# EAGLE design mega328_withheaders_andxbee (EAGLE 6.3)
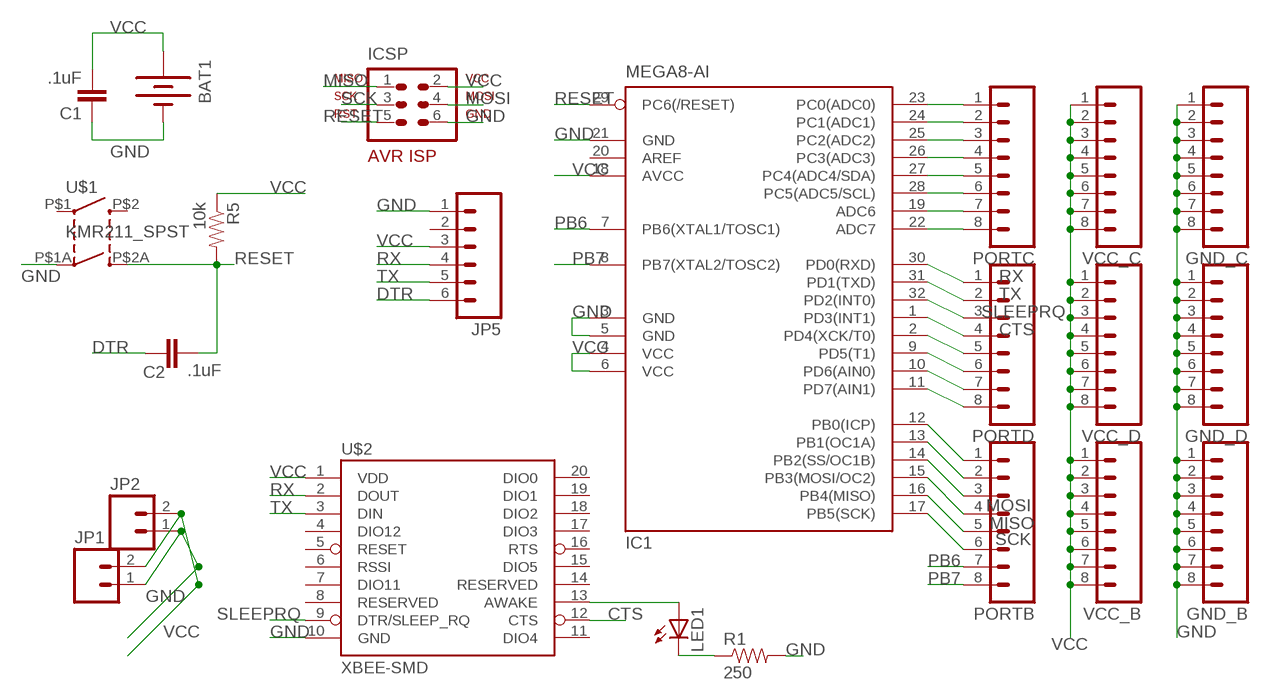
[diagram p0: schematic, sheet 1]

## Parts
BAT1  BATTERY20SMD  [BATTCON_20MM]
C1  .1uF  CAP0603-CAP  [0603-CAP]
C2  .1uF  CAP0603-CAP  [0603-CAP]
GND_B  M081X08  [1X08]
GND_C  M081X08  [1X08]
GND_D  M081X08  [1X08]
IC1  MEGA8-AI  [TQFP32-08]
ICSP  ISP  AVR-ISP-6VERT  [AVR-ISP-6]
JP1  M02PTH  [1X02]
JP2  M02PTH  [1X02]
JP5  M06SIP  [1X06]
LED1  LEDCHIP-LED0603  [CHIP-LED0603]
PORTB  M081X08  [1X08]
PORTC  M081X08  [1X08]
PORTD  M081X08  [1X08]
R1  250  RESISTOR0603-RES  [0603-RES]
R5  10k  RESISTOR0603-RES  [0603-RES]
U$1  KMR211_SPST  [KMR211_SPST]
U$2  XBEE-SMD  [XBEE-SMD]
VCC_B  M081X08  [1X08]
VCC_C  M081X08  [1X08]
VCC_D  M081X08  [1X08]

## Nets
B0: IC1.12(PB0(ICP)) PORTB.1
C0: IC1.23(PC0(ADC0)) PORTC.1
CTS: IC1.1(PD3(INT1)) PORTD.4 U$2.12(CTS)
DTR: C2.1 JP5.6
GND: BAT1.2(-) C1.1 GND_B.1 GND_B.2 GND_B.3 GND_B.4 GND_B.5 GND_B.6 GND_B.7 GND_B.8 GND_C.1 GND_C.2 GND_C.3 GND_C.4 GND_C.5 GND_C.6 GND_C.7 GND_C.8 GND_D.1 GND_D.2 GND_D.3 GND_D.4 GND_D.5 GND_D.6 GND_D.7 GND_D.8 IC1.3(GND) IC1.5(GND) IC1.21(GND) ICSP.6 JP1.1 JP2.1 JP5.1 R1.2 U$1.P$1A(1B) U$2.10(GND)
MISO: IC1.16(PB4(MISO)) ICSP.1 PORTB.5
MOSI: IC1.15(PB3(MOSI/OC2)) ICSP.4 PORTB.4
N$2: IC1.24(PC1(ADC1)) PORTC.2
N$3: IC1.25(PC2(ADC2)) PORTC.3
N$4: IC1.26(PC3(ADC3)) PORTC.4
N$5: IC1.27(PC4(ADC4/SDA)) PORTC.5
N$6: IC1.28(PC5(ADC5/SCL)) PORTC.6
N$7: IC1.19(ADC6) PORTC.7
N$8: IC1.22(ADC7) PORTC.8
N$13: IC1.2(PD4(XCK/T0)) PORTD.5
N$14: IC1.9(PD5(T1)) PORTD.6
N$15: IC1.10(PD6(AIN0)) PORTD.7
N$16: IC1.11(PD7(AIN1)) PORTD.8
N$17: IC1.14(PB2(SS/OC1B)) PORTB.3
N$18: IC1.13(PB1(OC1A)) PORTB.2
N$20: LED1.A U$2.13(AWAKE)
N$21: LED1.C R1.1
PB6: IC1.7(PB6(XTAL1/TOSC1)) PORTB.7
PB7: IC1.8(PB7(XTAL2/TOSC2)) PORTB.8
RESET: C2.2 IC1.29(PC6(/RESET)) ICSP.5 R5.2 U$1.P$2A(2B)
RX: IC1.30(PD0(RXD)) JP5.4 PORTD.1 U$2.2(DOUT)
SCK: IC1.17(PB5(SCK)) ICSP.3 PORTB.6
SLEEPRQ: IC1.32(PD2(INT0)) PORTD.3 U$2.9(DTR/SLEEP_RQ)
TX: IC1.31(PD1(TXD)) JP5.5 PORTD.2 U$2.3(DIN)
VCC: BAT1.1(+) C1.2 IC1.4(VCC) IC1.6(VCC) IC1.18(AVCC) ICSP.2 JP1.2 JP2.2 JP5.3 R5.1 U$2.1(VDD) VCC_B.1 VCC_B.2 VCC_B.3 VCC_B.4 VCC_B.5 VCC_B.6 VCC_B.7 VCC_B.8 VCC_C.1 VCC_C.2 VCC_C.3 VCC_C.4 VCC_C.5 VCC_C.6 VCC_C.7 VCC_C.8 VCC_D.1 VCC_D.2 VCC_D.3 VCC_D.4 VCC_D.5 VCC_D.6 VCC_D.7 VCC_D.8
Unconnected: IC1.20(AREF) JP5.2 U$1.P$1(1A) U$1.P$2(2A) U$2.4(DIO12) U$2.5(RESET) U$2.6(RSSI) U$2.7(DIO11) U$2.8(RESERVED) U$2.11(DIO4) U$2.14(RESERVED) U$2.15(DIO5) U$2.16(RTS) U$2.17(DIO3) U$2.18(DIO2) U$2.19(DIO1) U$2.20(DIO0)

## Library data of the parts
BAT1 = SparkFun-Electromechanical:BATTERY: Battery Holders Various common sizes : AA, AAA, 20mm coin cell and 12mm coin cell.
C1 C2 = SparkFun-Passives:CAP: Capacitor Standard 0603 ceramic capacitor, and 0.1" leaded capacitor.
GND_B GND_C GND_D PORTB PORTC PORTD VCC_B VCC_C VCC_D = SparkFun-Connectors:M08: Header 8 Standard 8-pin 0.1" header. Use with straight break away headers (SKU : PRT-00116), right angle break away headers (PRT-00553), swiss pins (PRT-00743), machine pins (PRT-00117), and female headers (PRT-00115).
IC1 = atmel:MEGA8: MICROCONTROLLER 8 Kbytes FLASH, 1 kbytes SRAM, 512 bytes EEPROM, USART, 6-channel 10 bit ADC, 2-channel 8 bit ADC Pin compatible with Atmega48, ATMega88, ATMega168 Source: avr.lbr; MPN: ATMEGA8-16AU; OC_FARNELL: 9171371; OC_NEWARK: 73M8863
ICSP = avr-7:AVR-ISP-6: AVR ISP-6 Serial Programming Header
JP1 JP2 = SparkFun-Connectors:M02: Header 2 Standard 2-pin 0.1" header. Use with straight break away headers (SKU : PRT-00116), right angle break away headers (PRT-00553), swiss pins (PRT-00743), machine pins (PRT-00117), and female headers (PRT-00115). Molex polarized connector foot print use with SKU : PRT-08233 with associated crimp pins and housings.
JP5 = SparkFun-Connectors:M06: Header 6 Standard 6-pin 0.1" header. Use with straight break away headers (SKU : PRT-00116), right angle break away headers (PRT-00553), swiss pins (PRT-00743), machine pins (PRT-00117), and female headers (PRT-00115). Molex polarized connector foot print use with SKU : PRT-08094 with associated crimp pins and housings. NOTES ON THE VARIANTS LOCK and LOCK_LONGPADS... This footprint was designed to help hold the alignment of a through-hole component (i.e. 6-pin header) while soldering it into place. You may notice that each hole has been shifted either up or down by 0.005 of an inch from it's more standard position (which is a perfectly straight line). This slight alteration caused the pins (the squares in the middle) to touch the edges of the holes. Because they are alternating, it causes a "brace" to hold the component in place. 0.005 has proven to be the perfect amount of "off-center" position when using our standard breakaway headers. Although looks a little odd when you look at the bare footprint, once you have a header in there, the alteration is very hard to notice. Also, if you push a header all the way into place, it is covered up entirely on the bottom side. This idea of altering the position of holes to aid alignment will be further integrated into the Sparkfun Library for other footprints. It can help hold any component with 3 or more connection pins.
LED1 = adafruit:LED: LED OSRAM: - CHIPLED LG R971, LG N971, LY N971, LG Q971, LY Q971, LO R971, LY R971 LH N974, LH R974 LS Q976, LO Q976, LY Q976 LO Q996 - Hyper CHIPLED LW Q18S LB Q993, LB Q99A, LB R99A - SideLED LS A670, LO A670, LY A670, LG A670, LP A670 LB A673, LV A673, LT A673, LW A673 LH A674 LY A675 LS A676, LA A676, LO A676, LY A676, LW A676 LS A679, LY A679, LG A679 - Hyper Micro SIDELED® LS Y876, LA Y876, LO Y876, LY Y876 LT Y87S - SmartLED LW L88C, LW L88S LB L89C, LB L89S, LG L890 LS L89K, LO L89K, LY L89K LS L896, LA L896, LO L896, LY L896 - TOPLED LS T670, LO T670, LY T670, LG T670, LP T670 LSG T670, LSP T670, LSY T670, LOP T670, LYG T670 LG T671, LOG T671, LSG T671 LB T673, LV T673, LT T673, LW T673 LH T674 LS T676, LA T676, LO T676, LY T676, LB T676, LH T676, LSB T676, LW T676 LB T67C, LV T67C, LT T67C, LS T67K, LO T67K, LY T67K, LW E67C LS E67B, LA E67B, LO E67B, LY E67B, LB E67C, LV E67C, LT E67C LW T67C LS T679, LY T679, LG T679 LS T770, LO T770, LY T770, LG T770, LP T770 LB T773, LV T773, LT T773, LW T773 LH T774 LS E675, LA E675, LY E675, LS T675 LS T776, LA T776, LO T776, LY T776, LB T776 LHGB T686 LT T68C, LB T68C - Hyper Mini TOPLED® LB M676 - Mini TOPLED Santana® LG M470 LS M47K, LO M47K, LY M47K Source: http://www.osram.convergy.de/
R1 = my library:RESISTOR: Resistor Basic schematic elements and footprints for 0603, 1206, and PTH resistors.
R5 = SparkFun-Passives:RESISTOR: Resistor Basic schematic elements and footprints for 0603, 1206, and PTH resistors.
U$1 = my library:KMR211_SPST: KMR, KMR211, SPST
U$2 = my library:XBEE-SMD: XBEE

## Board
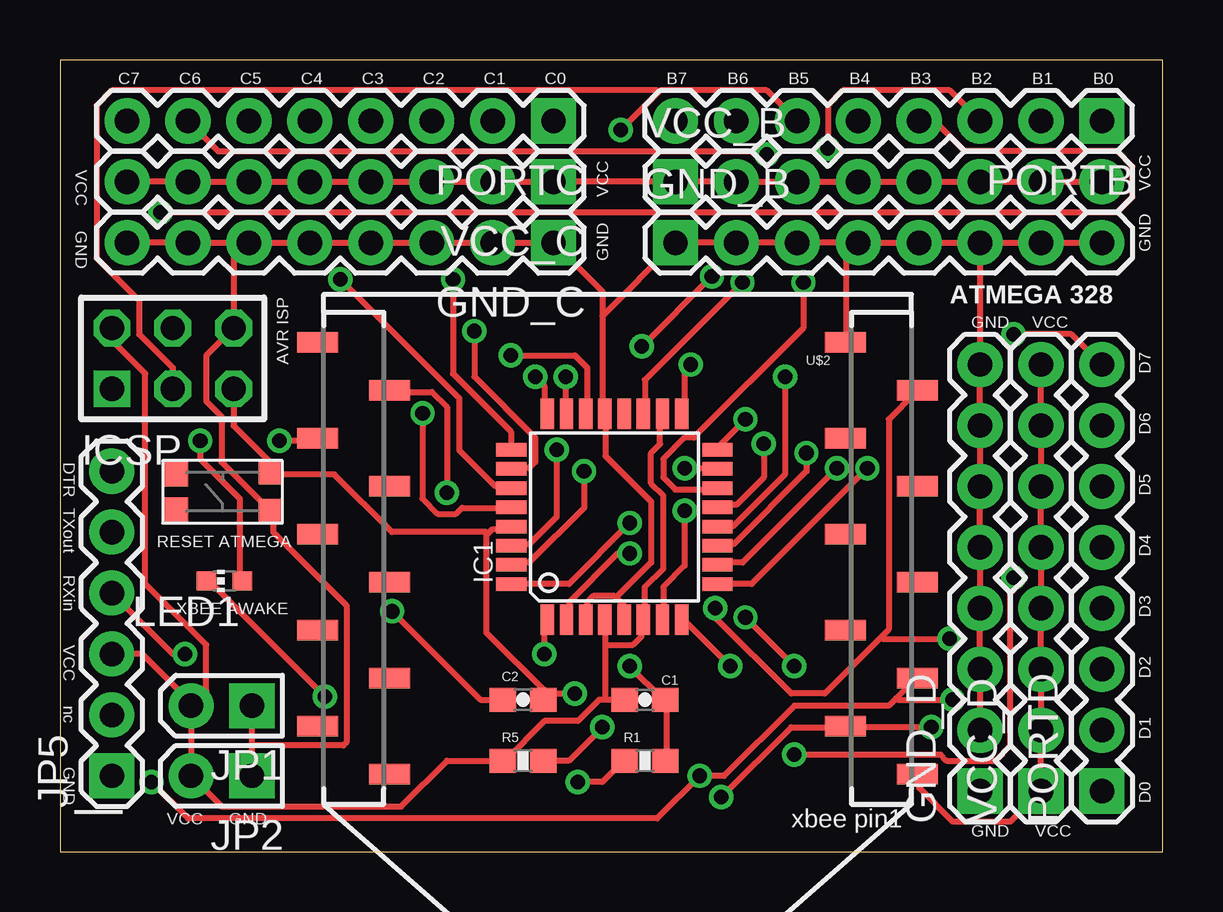
[diagram p1: board, top side]
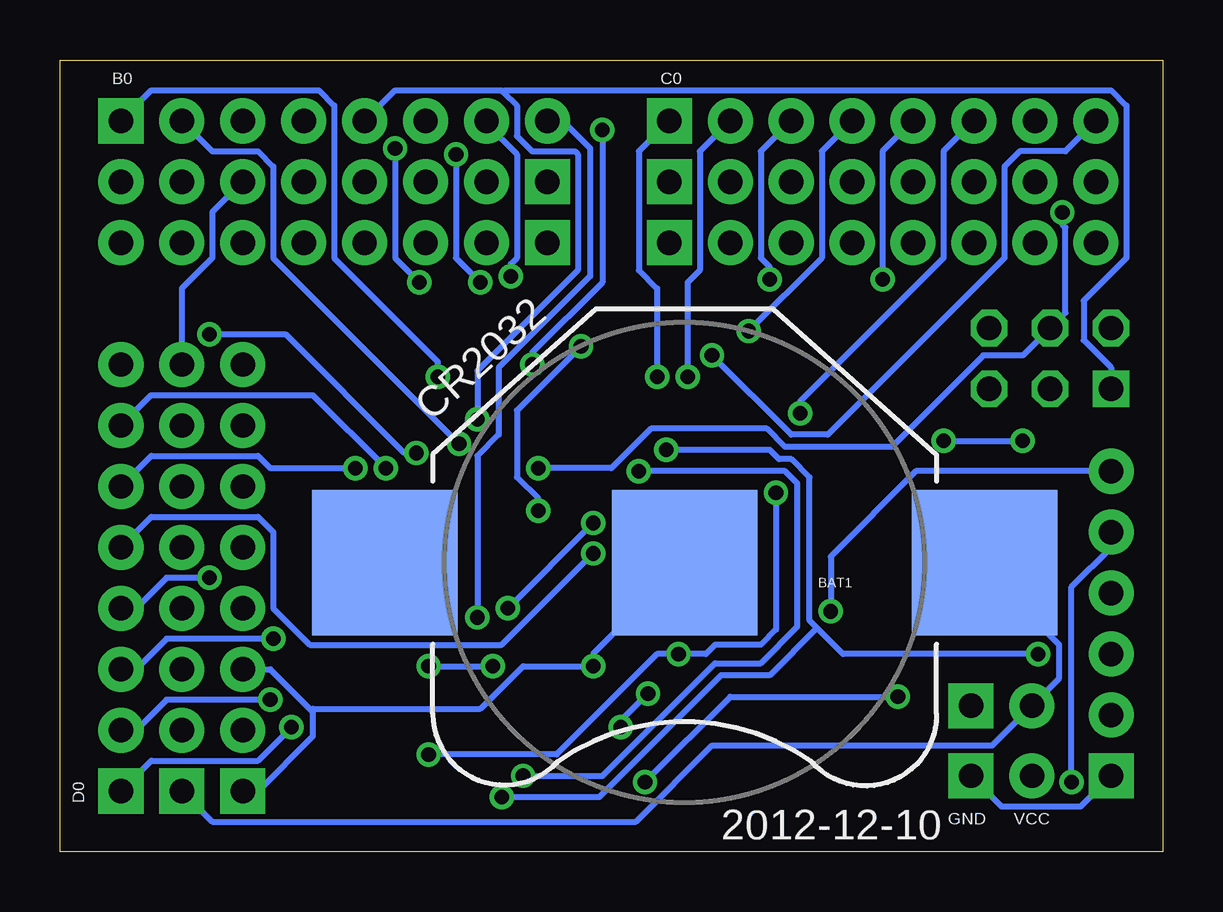
[diagram p2: board, bottom side, seen from below]

Size 45.97 x 33.02 mm. Coordinates in mm from the lower left corner, seen from the top.
Outline: 0,0 45.97,0 45.97,33.02 0,33.02 0,0
Copper layers (1*16): Top 0.035mm / dielectric 1.5mm / Bottom 0.035mm
Design rules "default": minimum track width 10mil, minimum drill 24mil, track to track 8mil, track to pad 8mil, pad to pad 8mil, via to via 8mil, smd to smd 8mil, copper to edge 40mil, drill to drill 8mil, minimum pad ring 10mil, minimum via ring 8mil, stop-mask expansion 4mil, vias tented up to drill 0mil, thermal gap 10mil

### Footprints (pad centres in the part's own frame; a part is rotated, then mirrored left to right if it is on the bottom)
BATTCON_20MM = smd 6.07 x 6.07: 1 -12.5,0; 2 0,0; 3 12.5,0
0603-CAP = smd 1.1 x 1: 1 -0.85,0; 2 0.85,0
1X08 = drill 1.016 pad 1.88 square: 1 0,0 | drill 1.016 pad 1.88: 2 2.54,0; 3 5.08,0; 4 7.62,0; 5 10.16,0; 6 12.7,0; 7 15.24,0; 8 17.78,0
TQFP32-08 = smd 1.27 x 0.559: 1 -4.293,2.8; 2 -4.293,2; 3 -4.293,1.2; 4 -4.293,0.4; 5 -4.293,-0.4; 6 -4.293,-1.2; 7 -4.293,-2; 8 -4.293,-2.8; 17 4.293,-2.8; 18 4.293,-2; 19 4.293,-1.2; 20 4.293,-0.4; 21 4.293,0.4; 22 4.293,1.2; 23 4.293,2; 24 4.293,2.8 | smd 0.559 x 1.27: 9 -2.8,-4.293; 10 -2,-4.293; 11 -1.2,-4.293; 12 -0.4,-4.293; 13 0.4,-4.293; 14 1.2,-4.293; 15 2,-4.293; 16 2.8,-4.293; 25 2.8,4.293; 26 2,4.293; 27 1.2,4.293; 28 0.4,4.293; 29 -0.4,4.293; 30 -1.2,4.293; 31 -2,4.293; 32 -2.8,4.293
AVR-ISP-6 = drill 1.016 square: 1 -2.54,-1.27 | drill 1.016 octagon: 2 -2.54,1.27; 3 0,-1.27; 4 0,1.27; 5 2.54,-1.27; 6 2.54,1.27
1X02 = drill 1.016 pad 1.88 square: 1 0,0 | drill 1.016 pad 1.88: 2 2.54,0
1X06 = drill 1.016 pad 1.88 square: 1 0,0 | drill 1.016 pad 1.88: 2 2.54,0; 3 5.08,0; 4 7.62,0; 5 10.16,0; 6 12.7,0
CHIP-LED0603 = smd 0.8 x 0.8: A 0,-0.75; C 0,0.75
0603-RES = smd 1.1 x 1: 1 -0.85,0; 2 0.85,0
KMR211_SPST = smd 1.067 x 1.067: P$1 4.47,-0.533; P$2 4.47,-2.057 | smd 1 x 1: P$1A 0.5,-0.5; P$2A 0.5,-2.1
XBEE-SMD = smd 1.7 x 0.85: 1 -12.5,9.84; 2 -9.5,7.84; 3 -12.5,5.84; 4 -9.5,3.84; 5 -12.5,1.84; 6 -9.5,-0.16; 7 -12.5,-2.16; 8 -9.5,-4.16; 9 -12.5,-6.16; 10 -9.5,-8.16; 11 12.5,-8.16; 12 9.5,-6.16; 13 12.5,-4.16; 14 9.5,-2.16; 15 12.5,-0.16; 16 9.5,1.84; 17 12.5,3.84; 18 9.5,5.84; 19 12.5,7.84; 20 9.5,9.84

### Placement (x,y rotation side)
BAT1  19.94,12.06 180 bottom
C1  24.38,6.35 180 top
C2  19.3,6.35 0 top
GND_B  25.65,25.4 0 top
GND_C  20.57,25.4 180 top
GND_D  38.35,2.54 90 top
IC1  23.11,13.97 90 top
ICSP  4.7,20.57 0 top
JP1  8,6.1 180 top
JP2  8,3.17 180 top
JP5  2.16,3.17 90 top
LED1  6.86,11.3 90 top
PORTB  43.43,30.48 180 top
PORTC  20.57,30.48 180 top
PORTD  43.43,2.54 90 top
R1  24.38,3.81 0 top
R5  19.3,3.81 0 top
U$1  9.27,13.72 180 top
U$2  23.24,13.08 180 top
VCC_B  25.65,27.94 0 top
VCC_C  20.57,27.94 180 top
VCC_D  40.89,2.54 90 top

### Tracks (layer width: path | path; a pad name or v marks a point on that pad's centre or on a via)
B0  (via drill 0.61)
  Top 0.254: v30.23,19.81 30.23,15.75 28.07,13.59 27.43,13.59 IC1.12
  Bottom 0.254: v30.23,19.81 30.23,20.45 34.54,24.77 34.54,31.11 35.18,31.75 42.16,31.75 PORTB.1
C0  (via drill 0.61)
  Top 0.254: v21.08,19.81 21.08,18.29 IC1.23
  Bottom 0.254: v21.08,19.81 21.08,23.5 21.84,24.26 21.84,29.21 PORTC.1
CTS  (via drill 0.61)
  Top 0.254: v20.19,8.26 20.19,9.65 IC1.1 | v16.13,14.99 16.13,18.54 15.49,19.18 13.84,19.18 U$2.12 | v39.75,11.43 39.75,10.92 39.62,10.79 39.62,4.45 38.99,3.81 36.96,3.81 36.7,4.06 v30.61,4.06
  Bottom 0.254: v16.13,14.99 16.13,9.27 16.76,8.64 18.67,8.64 19.05,8.26 v20.19,8.26 21.08,8.26 25.27,4.06 v30.61,4.06 | PORTD.4 42.8,10.16 41.53,11.43 v39.75,11.43
DTR  (via drill 0.61)
  Top 0.254: C2.1 17.53,6.35 v13.84,10.03
  Bottom 0.254: v13.84,10.03 13.84,12.32 10.29,15.88 JP5.6
GND  (via drill 0.61)
  Top 0.254: R1.2 25.27,3.81 25.27,6.35 C1.1 25.15,6.35 v23.75,7.75 | GND_D.2 GND_D.3 GND_D.4 GND_D.5 GND_D.6 GND_D.7 GND_D.8 GND_B.6 | GND_B.4 32.77,24.89 32.77,21.34 U$2.10 | GND_B.4 GND_B.3 GND_B.2 GND_B.1 22.61,22.35 | GND_B.4 GND_B.5 GND_B.6 | GND_B.6 GND_B.7 GND_B.8 | 23.18,10.6 23.5,10.29 23.5,9.78 IC1.5 | 23.18,10.6 23.11,10.67 22.23,10.67 21.97,10.41 21.97,9.78 IC1.3 | 22.61,22.35 22.61,23.37 GND_C.1 GND_C.2 GND_C.3 GND_C.4 GND_C.5 GND_C.6 7.24,25.4 | 22.61,22.35 22.61,18.29 IC1.21 22.73,18.16 22.73,16.51 24.64,14.61 24.64,12.06 23.18,10.6 | JP2.1 8,4.45 | 8,4.45 JP1.1 | GND_C.8 GND_C.7 7.24,25.4 | 7.24,25.4 ICSP.6 6.1,20.7 6.1,18.8 6.73,18.16 6.73,16.26 U$1.P$1A 8.89,14.1 8.89,13.34 11.94,10.29 11.94,4.57 11.81,4.45 8,4.45
  Bottom 0.254: BAT1.2 23.75,8.26 v23.75,7.75 26.67,7.75 28.45,5.97 35.43,5.97 35.5,5.91 | GND_D.1 37.72,2.54 35.43,4.83 35.43,5.84 35.5,5.91 | 35.5,5.91 37.21,7.62 GND_D.3 | JP5.1 3.43,1.91 6.73,1.91 JP2.1
MISO  (via drill 0.61)
  Top 0.254: v28.58,18.03 27.43,16.89 IC1.16
  Bottom 0.254: v28.58,18.03 28.58,20.07 24.38,24.26 24.38,29.08 24.51,29.21 26.29,29.21 26.92,29.84 26.92,31.11 27.5,31.69 | 27.5,31.69 27.56,31.75 32,31.75 PORTB.5 | ICSP.1 2.16,20.19 3.3,21.34 3.3,22.99 1.52,24.77 1.52,31.11 2.16,31.75 27.43,31.75 27.5,31.69
MOSI  (via drill 0.61)
  Top 0.254: v26.04,16 27.3,16 IC1.15 | PORTB.4 36.45,30.48 37.72,29.21 44.07,29.21 44.7,28.57 44.7,27.3 44.07,26.67 v4.19,26.67
  Bottom 0.254: v26.04,16 22.99,16 21.34,17.65 16.51,17.65 15.75,16.89 11.3,16.89 7.49,20.7 5.84,20.7 ICSP.4 4.06,22.48 4.06,26.04 4.19,26.16 v4.19,26.67
N$2  (via drill 0.61)
  Top 0.254: v19.81,19.81 20.19,19.43 20.19,18.29 IC1.24
  Bottom 0.254: v19.81,19.81 19.81,23.75 19.3,24.26 19.3,29.21 PORTC.2
N$3  (via drill 0.61)
  Top 0.254: v16.38,23.88 16.38,19.94 18.8,17.53 18.8,16.89 IC1.25
  Bottom 0.254: v16.38,23.88 16.38,24.38 16.76,24.77 16.76,29.21 PORTC.3
N$4  (via drill 0.61)
  Top 0.254: v17.27,21.72 17.27,19.81 19.81,17.27 19.81,16.26 19.56,16 18.92,16 IC1.26
  Bottom 0.254: v17.27,21.72 14.22,24.77 14.22,29.21 PORTC.4
N$5  (via drill 0.61)
  Top 0.254: v11.68,23.88 16.64,18.92 16.64,16.76 18.16,15.24 18.8,15.24 IC1.27
  Bottom 0.254: v11.68,23.88 11.68,29.21 PORTC.5
N$6  (via drill 0.61)
  Top 0.254: v15.11,18.29 15.11,14.73 15.75,14.1 16.51,14.1 16.76,14.35 18.8,14.35 IC1.28
  Bottom 0.254: v15.11,18.29 15.11,18.8 9.14,24.77 9.14,29.21 PORTC.6
N$7  (via drill 0.61)
  Top 0.254: v28.45,23.75 24.38,19.68 24.38,18.29 IC1.19 | v29.46,29.08 28.96,29.08 28.83,29.21 6.6,29.21 PORTC.7
  Bottom 0.254: v28.45,23.75 29.46,24.77 v29.46,29.08
N$8  (via drill 0.61)
  Top 0.254: v18.8,20.7 21.46,20.7 21.97,20.19 21.97,18.29 IC1.22
  Bottom 0.254: v18.8,20.7 15.49,17.4 13.97,17.4 6.6,24.77 6.6,28.57 5.97,29.21 4.06,29.21 PORTC.8
N$13  (via drill 0.61)
  Top 0.254: v23.75,12.45 23.24,12.45 21.21,10.41 21.21,9.78 IC1.2
  Bottom 0.254: v23.75,12.45 27.56,8.64 35.56,8.64 37.08,10.16 37.08,13.34 37.72,13.97 42.16,13.97 PORTD.5
N$14  (via drill 0.61)
  Top 0.254: v33.66,16 28.83,11.18 27.43,11.18 IC1.9
  Bottom 0.254: v33.66,16 37.21,16 37.72,16.51 42.16,16.51 PORTD.6
N$15  (via drill 0.61)
  Top 0.254: v32.38,16 28.45,12.06 27.43,12.06 IC1.10
  Bottom 0.254: v32.38,16 35.43,19.05 42.16,19.05 PORTD.7
N$16  (via drill 0.61)
  Top 0.254: v31.12,16.64 31.12,15.88 28.07,12.83 27.43,12.83 IC1.11 | v39.75,21.59 42.16,21.59 PORTD.8
  Bottom 0.254: v31.12,16.64 31.62,16.64 36.58,21.59 v39.75,21.59
N$17  (via drill 0.61)
  Top 0.254: v30.99,23.75 30.99,21.84 26.42,17.27 26.04,17.27 25.15,16.38 25.15,15.62 25.65,15.11 27.3,15.11 IC1.14 | v32,29.34 32,31.11 32.64,31.75 37.08,31.75 PORTB.3
  Bottom 0.254: v30.99,23.75 32,24.77 v32,29.34
N$18  (via drill 0.61)
  Top 0.254: v29.34,17.02 29.34,15.62 28.19,14.48 27.43,14.48 IC1.13
  Bottom 0.254: v29.34,17.02 37.08,24.77 37.08,28.57 37.72,29.21 39.62,29.21 PORTB.2
N$20  (via drill 0.61)
  Top 0.254: v5.84,17.14 5.84,16.38 7.49,14.73 7.49,11.3 LED1.A | v9.14,17.14 10.67,17.14 U$2.13
  Bottom 0.254: v9.14,17.14 v5.84,17.14
N$21  (via drill 0.61)
  Top 0.254: v11.05,6.48 6.22,11.3 LED1.C | v21.59,2.92 22.61,2.92 23.5,3.81 R1.1
  Bottom 0.254: v11.05,6.48 18.03,6.48 v21.59,2.92
PB6  (via drill 0.61)
  Top 0.254: v26.04,14.22 26.04,11.94 25.15,11.05 25.15,9.78 IC1.7 | v27.18,24 v24.26,21.08
  Bottom 0.254: v26.04,14.22 26.04,14.73 26.92,15.62 26.92,18.41 v24.26,21.08 | v27.18,24 27.18,24.51 26.92,24.77 26.92,29.08 28.19,30.35 PORTB.7
PB7  (via drill 0.61)
  Top 0.254: v27.94,7.75 26.04,9.65 IC1.8 | v28.58,9.78 v30.61,7.75
  Bottom 0.254: v30.61,7.75 v27.94,7.75 | v28.58,9.78 28.58,16.51 27.69,17.4 27.69,20.19 23.88,24 23.88,29.34 25.02,30.48 PORTB.8
RESET  (via drill 0.61)
  Top 0.254: ICSP.5 7.24,17.78 8.76,16.26 8.76,15.88 U$1.P$2A 8.89,15.75 11.43,15.75 13.84,13.34 17.78,13.34 17.84,13.27 | R5.2 21.21,3.81 v22.61,5.21 | v21.46,6.6 20.45,6.6 20.19,6.35 C2.2 20.32,6.6 17.78,9.14 17.78,13.21 17.84,13.27 | 17.84,13.27 18.03,13.46 18.8,13.46 IC1.29
  Bottom 0.254: v22.61,5.21 22.61,5.46 v21.46,6.6
RX  (via drill 0.61)
  Top 0.254: v36.32,5.21 32.77,5.21 U$2.2 32.64,5.21 30.48,5.21 v27.56,2.29 | v20.7,16.76 20.7,13.97 19.56,12.83 18.92,12.83 IC1.30 | v5.21,8.26 4.7,8.26 JP5.4
  Bottom 0.254: v36.32,5.21 37.72,3.81 42.16,3.81 PORTD.1 | v20.7,16.76 16.38,16.76 16,16.38 15.49,16.38 14.73,15.62 14.73,9.65 14.41,9.34 | 14.41,9.34 13.33,8.26 v5.21,8.26 | v27.56,2.29 23.5,2.29 18.42,7.37 16.38,7.37 14.41,9.34
SCK  (via drill 0.61)
  Top 0.254: v26.29,20.32 26.04,20.07 26.04,18.29 IC1.17 | 24.96,31.69 25.02,31.75 29.46,31.75 PORTB.6 | 24.96,31.69 v23.37,30.1 | ICSP.3 4.7,20.19 3.3,21.59 3.3,22.99 1.52,24.77 1.52,31.11 2.16,31.75 24.89,31.75 24.96,31.69
  Bottom 0.254: v26.29,20.32 26.29,20.83 23.37,23.75 v23.37,30.1
SLEEPRQ  (via drill 0.61)
  Top 0.254: v23.75,13.72 21.21,11.18 18.92,11.18 IC1.32 | v27.3,10.16 27.3,9.78 30.48,6.6 31.88,6.6 34.23,8.95 | 34.23,8.95 34.54,9.27 34.54,18.03 35.69,19.18 U$2.9 | v37.08,8.89 34.29,8.89 34.23,8.95
  Bottom 0.254: v27.3,10.16 v23.75,13.72 | PORTD.3 42.8,7.62 41.53,8.89 v37.08,8.89
TX  (via drill 0.61)
  Top 0.254: v21.84,15.88 21.84,14.35 19.56,12.06 18.92,12.06 IC1.31 | 34.86,6.41 35.69,7.24 U$2.3 | 34.86,6.41 34.54,6.1 30.61,6.1 27.69,3.17 v26.67,3.17 24.89,1.4 5.33,1.4 v3.81,2.92 | v37.21,6.35 34.92,6.35 34.86,6.41
  Bottom 0.254: v21.84,15.88 15.75,15.88 15.24,15.37 15.24,9.4 16.76,7.87 18.67,7.87 23.37,3.17 v26.67,3.17 | JP5.5 2.16,12.7 3.81,11.05 v3.81,2.92 | PORTD.2 42.8,5.08 41.53,6.35 v37.21,6.35
VCC
  Top 0.254: C1.2 22.73,6.35 | 22.73,6.35 22.48,6.35 21.59,5.46 20.19,5.46 18.54,3.81 R5.1 16.13,3.81 14.22,1.91 6.73,1.91 JP2.2 JP1.2 | 22.73,6.35 22.73,8.64 | 22.73,8.64 22.73,9.65 IC1.4 | 22.73,8.64 23.88,8.64 24.26,9.02 24.26,9.65 IC1.6 24.38,9.78 24.38,11.05 25.15,11.81 25.15,14.86 24.64,15.37 24.64,16.64 25.02,17.02 25.02,18.16 IC1.18 | ICSP.2 2.16,21.34 3.56,19.94 3.56,11.18 6.1,8.64 6.1,6.73 JP1.2 | JP5.3 3.43,8.26 5.46,6.22 JP1.2 | VCC_D.8 VCC_D.7 VCC_D.6 VCC_D.5 VCC_D.4 VCC_D.3 VCC_D.2 VCC_D.1 39.62,1.27 37.21,1.27 35.81,2.67 35.81,3.17 U$2.1 | VCC_C.8 VCC_C.7 VCC_C.6 VCC_C.5 VCC_C.4 VCC_C.3 VCC_C.2 VCC_C.1 VCC_B.1 VCC_B.2 VCC_B.3 VCC_B.4 VCC_B.5 VCC_B.6 VCC_B.7 VCC_B.8
  Bottom 0.254: BAT1.1 7.37,12.06 7.37,11.68 4.32,8.64 4.32,7.24 JP1.2 7.11,4.45 18.8,4.45 21.97,1.27 39.62,1.27 VCC_D.1 | VCC_D.8 40.89,23.5 39.62,24.77 39.62,26.67 VCC_B.6

### Text on the board
tPlace: C7 | C6 | C5 | C4 | C3 | C2 | C1 | C0 | B7 | B6 | B5 | B4 | B3 | B2 | B1 | B0 | VCC | VCC | VCC | GND | GND | GND | ATMEGA 328 | GND | VCC | AVR ISP | D7 | D6 | DTR | D5 | TXout | RESET ATMEGA | RXin | D4 | XBEE AWAKE | D3 | VCC | D2 | nc | D1 | GND | VCC | GND | D0 | | | xbee pin1 | GND | VCC
bPlace: C0 | B0 | CR2032 | VCC | GND | D0 | 2012-12-10